# EAGLE design Untitled (EAGLE 7.2.0)
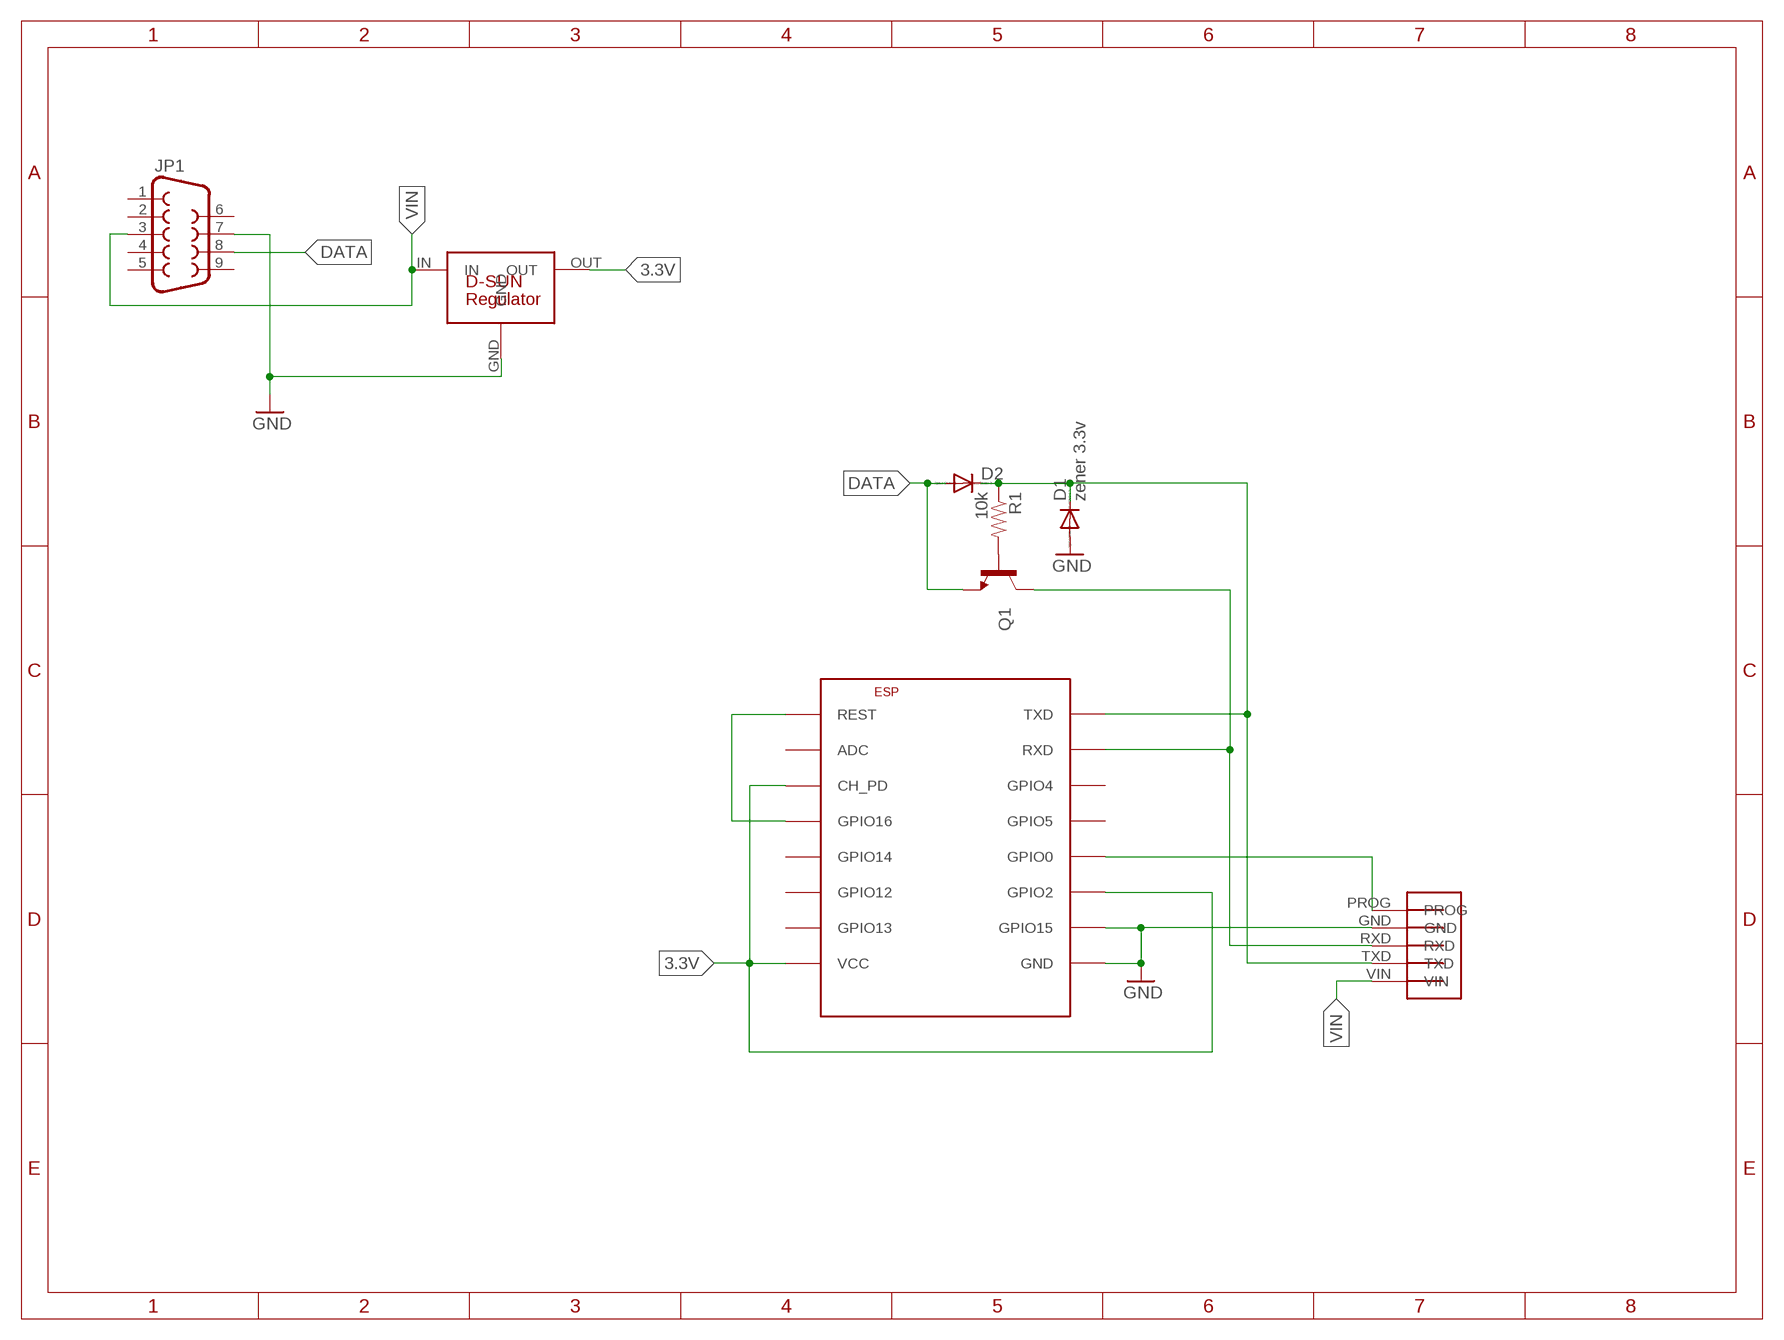
[diagram p0: schematic, sheet 1]

## Parts
D1  zener 3.3v  DIODE-MINIMELF  [MINIMELF]
D2  DIODE-MINIMELF  [MINIMELF]
ESP  ESP8266-07  [ESP-07]
JP1  DB9MALE  [DB9_MALE]
Q1  TRANSISTOR_NPNSOT23-3  [SOT23-3]
R1  10k  RESISTOR0805-RES  [0805]
U$3  ESPROG  [ESPROG]
U$4  D-SUN-REG  [D-SUN-REG]

## Nets
3.3V: ESP.CH_PD ESP.GPIO2 ESP.VCC U$4.OUT
DATA: D2.A JP1.8 Q1.2(E)
GND: D1.A ESP.GND ESP.GPIO15 JP1.7 U$3.GND U$4.GND
N$1: D1.C D2.C ESP.TXD R1.1 U$3.TXD
N$3: ESP.RXD Q1.3(C) U$3.RXD
N$5: ESP.GPIO0 U$3.PROG
N$6: ESP.GPIO16 ESP.REST
N$7: Q1.1(B) R1.2
VIN: JP1.3 U$3.VIN U$4.IN
Unconnected: ESP.ADC ESP.GPIO4 ESP.GPIO5 ESP.GPIO12 ESP.GPIO13 ESP.GPIO14 JP1.1 JP1.2 JP1.4 JP1.5 JP1.6 JP1.9

## Library data of the parts
D1 D2 = diode:DIODE-: DIODE
ESP = lio:ESP8266
JP1 = SparkFun-Connectors:DB9: DB9 Connector Standard DB9 (D-Sub 9) serial connector. Can be used for CAN bus as well as RS485 and RS232. Footprint production proven. Spark Fun Electronics SKU : PRT-00429; PROD_ID: CONN-09904
Q1 = SparkFun-DiscreteSemi:TRANSISTOR_NPN: Generic NPN BJT MMBT2222A - TRANS-08049 (SOT-23, 1A 40V) MPSA42 - TRANS-09116 (SOT-23, 500mA 300V) MMBT5088LT1G - TRANS-11160 (SOT-23, 50 mA 30V) BC547 - COM-08928 <http://www.sparkfun.com/products/8928> (TO-92 45V 100mA) (1.Collector 2.Base 3.Emitter) 2N3904 - COM-00521 <http://www.sparkfun.com/products/521> (TO-92 40V 200mA) (1.Emitter 2.Base 3.Collector) P2N2222A - COM-12852 <http://www.sparkfun.com/products/12852> (TO-92 40V 600mA) (1.Collector 2.Base 3.Emitter); PROD_ID: TRANS-08049
R1 = SparkFun-Resistors:RESISTOR: Resistor Basic schematic elements and footprints for 0603, 1206, and PTH resistors.
U$3 = k3a:ESPROG: Card edge connector for programming Espressif modules
U$4 = k3a:D-SUN-REG: Mini D-SUN switching regulator

## Board
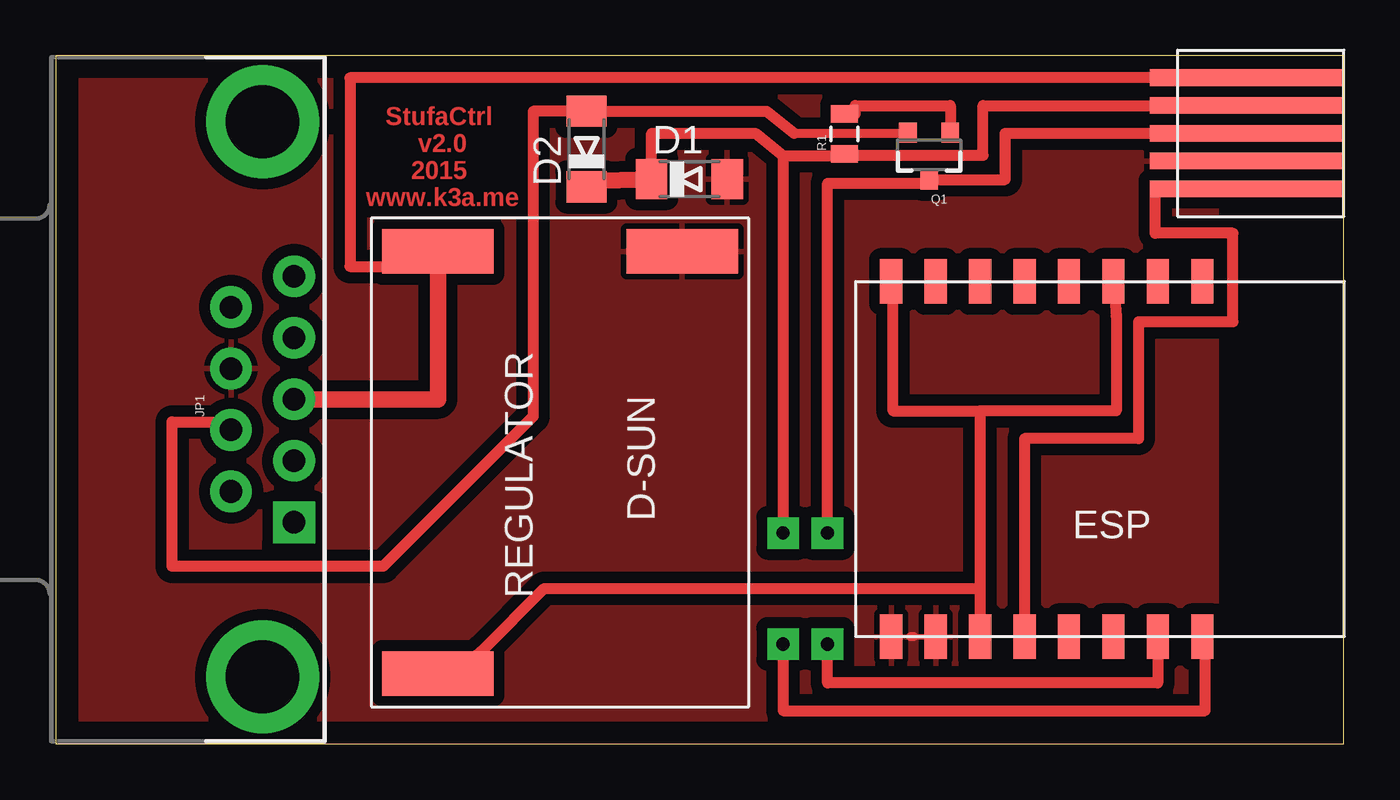
[diagram p1: board, top side]
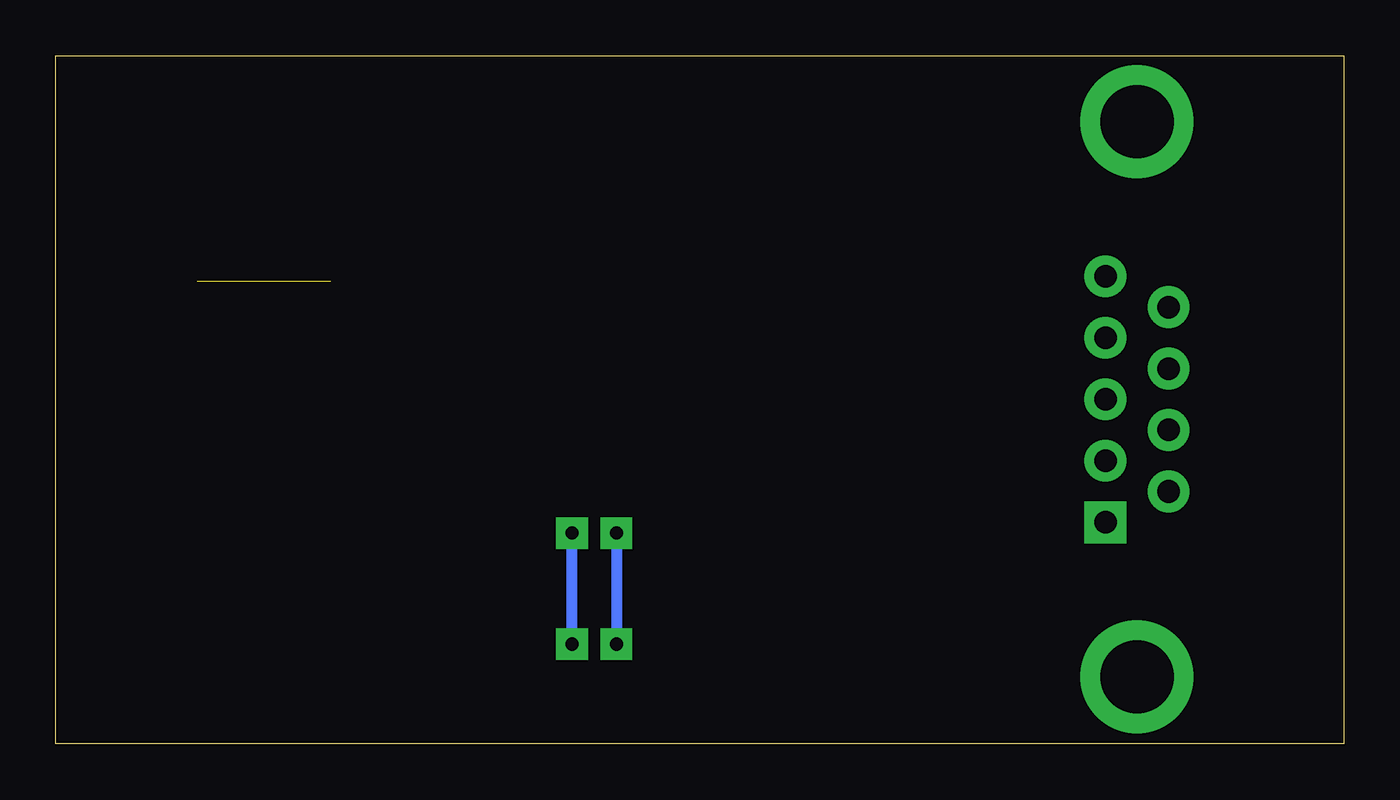
[diagram p2: board, bottom side, seen from below]

Size 58 x 31 mm. Coordinates in mm from the lower left corner, seen from the top.
Outline: 0,0 58,0 58,31 0,31 0,0
Copper layers (1*16): Top 0.035mm / dielectric 1.5mm / Bottom 0.035mm
Design rules "default": minimum track width 10mil, minimum drill 24mil, track to track 8mil, track to pad 8mil, pad to pad 8mil, via to via 8mil, smd to smd 8mil, copper to edge 40mil, drill to drill 8mil, minimum pad ring 10mil, minimum via ring 8mil, stop-mask expansion 4mil, vias tented up to drill 0mil, thermal gap 10mil

### Footprints (pad centres in the part's own frame; a part is rotated, then mirrored left to right if it is on the bottom)
MINIMELF = smd 1.4 x 1.8: A 1.7,0; C -1.7,0
ESP-07 = smd 1 x 2: ADC -1.6,-8; CH_PD 0.4,-8; GND 10.4,8; GPIO0 4.4,8; GPIO2 6.4,8; GPIO4 0.4,8; GPIO5 2.4,8; GPIO12 6.4,-8; GPIO13 8.4,-8; GPIO14 4.4,-8; GPIO15 8.4,8; GPIO16 2.4,-8; REST -3.6,-8; RXD -1.6,8; TXD -3.6,8; VCC 10.4,-8
DB9_MALE = drill 1.016 pad 1.88: 1 5.54,-1.42; 2 2.77,-1.42; 3 0,-1.42; 4 -2.77,-1.42; 6 4.15,1.42; 7 1.38,1.42; 8 -1.38,1.42; 9 -4.15,1.42 | drill 1.016 pad 1.88 square: 5 -5.54,-1.42 | drill 3.302 pad 5.08: G1 -12.5,0; G2 12.5,0
SOT23-3 = smd 0.8 x 0.9: 1 -0.95,-1; 2 0.95,-1; 3 0,1.1
0805 = smd 0.8 x 1.2: 1 -0.9,0; 2 0.9,0
ESPROG = smd 8.75 x 0.75: GND -4.375,2.5; PROG -4.375,1.25; RXD -4.375,3.75; TXD -4.375,5; VIN -4.375,6.25
D-SUN-REG = smd 2 x 5: GND -9.5,4.5; IN -9.5,-6.5; OUT 9.5,-6.5

### Placement (x,y rotation side)
D1  28.54,25.44 0 top
D2  23.9,26.79 90 top
ESP  48.02,12.83 180 top
JP1  9.32,15.52 90 top
Q1  39.33,26.52 180 top
R1  35.51,27.47 90 top
U$3  58,23.75 0 top
U$4  23.71,12.67 270 top

### Tracks (layer width: path | path; a pad name or v marks a point on that pad's centre or on a via)
3.3V
  Top 0.5: ESP.CH_PD 47.75,19.25 47.75,15 41.62,15 | ESP.VCC 37.7,20.58 37.7,15 41.62,15 | 41.62,15 41.62,7 | 41.62,7 ESP.GPIO2 | 18,3.17 19.25,4.25 22,7 41.62,7
  Top 1: U$4.OUT 18,3.17
DATA
  Top 0.406: 33.25,27.5 38.36,27.5
  Top 0.5: 33.25,27.5 32.01,28.49 D2.A 21.5,28.49 21.5,14.75 14.75,8 5.25,8 5.25,14.5 7.9,14.5 | 38.36,27.5 Q1.2
  Top 0.75: 7.9,14.5 JP1.8
GND
  Top 0.254: 38.62,4.83 ESP.GPIO15
  Top 0.406: 38.62,4.83 38.49,4.83
  pour Top (isolate 0.5): 0,31.25 52.25,31.5 52.25,0 -0.13,0
N$1  (via drill 0.6 pad 1.42)
  Top 0.406: R1.1 41.75,26.5 | 35.44,26.5 34,26.5
  Top 0.5: 54.38,28.75 U$3.TXD 41.75,28.75 41.75,26.5 35.44,26.5 | D1.C 26.84,27.5 31.5,27.5 32.75,26.5 | 32.75,26.5 35.44,26.5 | 35.44,26.5 R1.1 | 32.75,26.5 v32.75,9.5 | v32.75,4.5 32.75,1.5 51.75,1.5 51.75,4.83 ESP.TXD
  Top 0.75: D2.C 23.98,25.34 D1.C
  Bottom 0.5: v32.75,9.5 v32.75,4.5
N$3  (via drill 0.6 pad 1.42)
  Top 0.5: U$3.RXD 42.75,27.5 42.75,25.42 Q1.3 39.25,25.42 39,25.25 34.75,25.25 v34.75,9.5 | ESP.RXD 49.62,2.75 34.75,2.75 v34.75,4.5
  Bottom 0.5: v34.75,4.5 v34.75,9.5
N$5
  Top 0.5: ESP.GPIO0 43.62,13.75 48.75,13.75 48.75,19 53,19 53,23 49.5,23 49.5,25 U$3.PROG
N$6  (1 unrouted)
N$7
  Top 0.5: R1.2 36,28.37 36,28.75 40.28,28.75 Q1.1
VIN
  Top 0.5: U$3.VIN 13.25,30 13.25,21.5 17.21,21.5
  Top 0.75: JP1.3 17.21,15.52 U$4.IN 17.21,21.5

### Text on the board
Top: StufaCtrl / v2.0 / 2015 / www.k3a.me